# EAGLE design DIMMER (EAGLE 9.6.2)
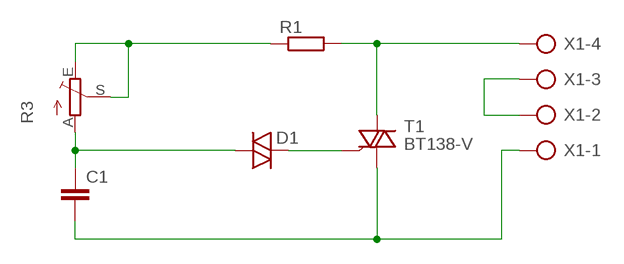
[diagram p0: schematic, sheet 1]

## Parts
C1  C15/5  [C15B5]
D1  DIAC-GT32  [GT32]
R1  R-EU_0207/10  [0207/10]
R3  TRIM_EU-CIP20C-4MM  [CIP20C-4MM]
T1  BT138-V  [TO220BV]
X1  AK500/4  [AK500/4]

## Nets
N$1: D1.2 T1.G
N$2: R1.2 T1.T2(A2) X1.4
N$3: X1.2 X1.3
N$4: C1.2 T1.T1(A1) X1.1
N$5: C1.1 D1.1 R3.A
N$6: R1.1 R3.E R3.S

## Library data of the parts
C1 = capacitor-wima:C: CAPACITOR naming: grid - package width
D1 = diode:DIAC-: DIAC
R1 = rcl:R-EU_: RESISTOR, European symbol; SPICEPREFIX: R
R3 = pot:TRIM_EU-: POTENTIOMETER
T1 = triac:BT138: TRIAC Source: http://www.semiconductors.philips.com BT138_SERIES_2.pdf
X1 = con-ptr500:AK500/4: CONNECTOR; OC_FARNELL: unknown; OC_NEWARK: unknown

## Board
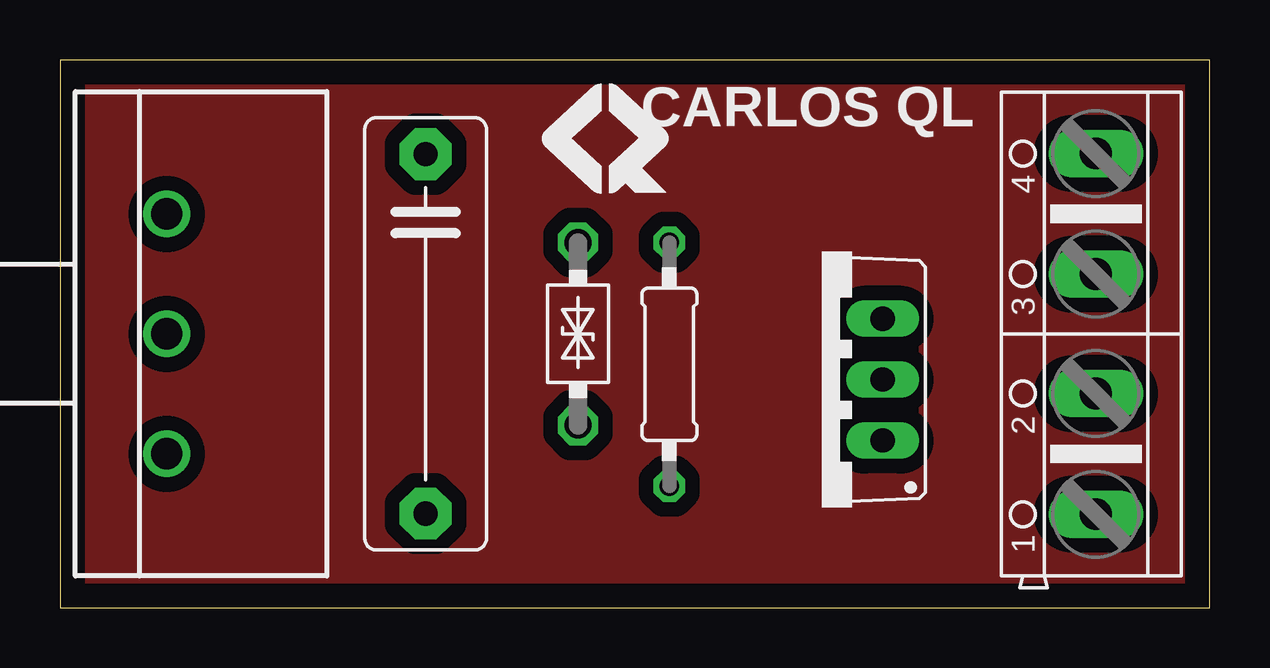
[diagram p1: board, top side]
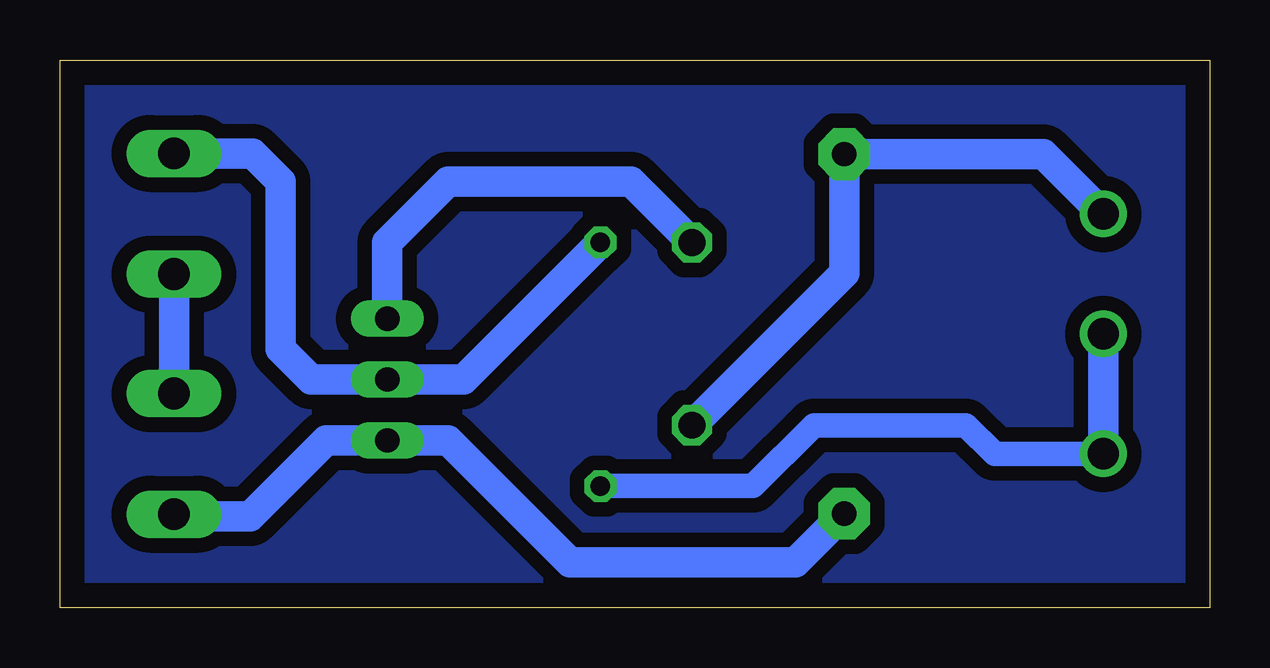
[diagram p2: board, bottom side, seen from below]

Size 47.93 x 22.85 mm. Coordinates in mm from the lower left corner, seen from the top.
Outline: 0,0 47.93,0 47.93,22.85 0,22.85 0,0
Copper layers (1*16): Top 0.035mm / dielectric 1.5mm / Bottom 0.035mm
Design rules "default": minimum track width 6mil, minimum drill 0.35mm, track to track 6mil, track to pad 6mil, pad to pad 6mil, via to via 6mil, smd to smd 6mil, copper to edge 40mil, drill to drill 6mil, minimum pad ring 10mil, minimum via ring 8mil, stop-mask expansion 4mil, vias tented up to drill 0mil, thermal gap 10mil

### Footprints (pad centres in the part's own frame; a part is rotated, then mirrored left to right if it is on the bottom)
C15B5 = drill 1.016 pad 2.159 octagon: 1 -7.493,0; 2 7.493,0
GT32 = drill 1.118 octagon: 1 -3.81,0; 2 3.81,0
0207/10 = drill 0.813 octagon: 1 -5.08,0; 2 5.08,0
CIP20C-4MM = drill 1.3 pad 1.93: A -5,0; E 5,0; S 0,0
TO220BV = drill 1.016 long: G 2.54,-2.54; T1 -2.54,-2.54; T2 0,-2.54
AK500/4 = drill 1.321 long: 1 -7.518,0; 2 -2.489,0; 3 2.489,0; 4 7.518,0

### Placement (x,y rotation side)
C1  15.24,11.43 270 top
D1  21.59,11.43 90 top
R1  25.4,10.16 90 top
R3  4.45,11.43 270 top
T1  31.75,9.53 90 top
X1  43.18,11.43 90 top

### Tracks (layer width: path | path; a pad name or v marks a point on that pad's centre or on a via)
N$1
  Bottom 1.27: D1.2 24.13,17.78 31.75,17.78 34.29,15.24 T1.G
N$2
  Bottom 1.27: X1.4 39.9,18.95 38.73,17.78 38.73,10.79 37.47,9.53 T1.T2 31.11,9.53 R1.2
N$3
  Bottom 1.27: X1.3 X1.2
N$4
  Bottom 1.27: X1.1 43.08,3.81 40.01,3.81 36.83,6.99 T1.T1 31.75,6.99 26.67,1.91 17.27,1.91 C1.2
N$5
  Bottom 1.27: R3.A 6.94,18.92 C1.1 15.24,13.97 D1.1
N$6
  Bottom 1.016: R3.E 8.97,6.43 10.16,7.62 16.51,7.62 19.05,5.08 R1.1
  Bottom 1.27: R3.S R3.E
N$7
  pour Bottom (isolate 0.61): 0.32,22.54 0.32,0.32 21.91,0.32 47.62,0.32 47.62,8.26 47.62,22.54
N$8
  pour Top (isolate 0.61): 0.32,0.32 37.78,0.32 47.62,0.32 47.62,22.23 0.32,22.23

### Text on the board
tNames: CARLOS QL